# EAGLE design platform_smd2_driver (EAGLE 6.5.0)
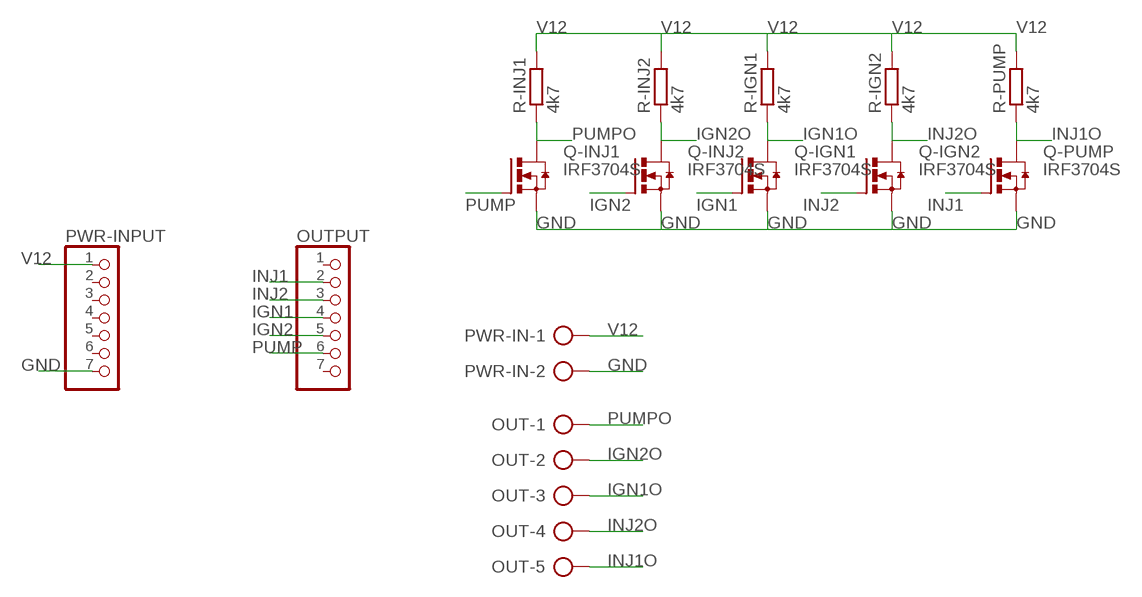
[diagram p0: schematic, sheet 1]

## Parts
OUT  AK300/5  [AK300/5]
OUTPUT  PINHD-1X7  [1X07]
PWR-IN  AK300/2  [AK300/2]
PWR-INPUT  PINHD-1X7  [1X07]
Q-IGN1  IRF3704S  [D2PACK]
Q-IGN2  IRF3704S  [D2PACK]
Q-INJ1  IRF3704S  [D2PACK]
Q-INJ2  IRF3704S  [D2PACK]
Q-PUMP  IRF3704S  [D2PACK]
R-IGN1  4k7  R-EU_M1206  [M1206]
R-IGN2  4k7  R-EU_M1206  [M1206]
R-INJ1  4k7  R-EU_M1206  [M1206]
R-INJ2  4k7  R-EU_M1206  [M1206]
R-PUMP  4k7  R-EU_M1206  [M1206]

## Nets
GND: PWR-IN.2 PWR-INPUT.7 Q-IGN1.3(S) Q-IGN2.3(S) Q-INJ1.3(S) Q-INJ2.3(S) Q-PUMP.3(S)
IGN1: OUTPUT.4 Q-IGN1.1(G)
IGN1O: OUT.3 Q-IGN1.2(D) R-IGN1.1
IGN2: OUTPUT.5 Q-INJ2.1(G)
IGN2O: OUT.2 Q-INJ2.2(D) R-INJ2.1
INJ1: OUTPUT.2 Q-PUMP.1(G)
INJ1O: OUT.5 Q-PUMP.2(D) R-PUMP.1
INJ2: OUTPUT.3 Q-IGN2.1(G)
INJ2O: OUT.4 Q-IGN2.2(D) R-IGN2.1
PUMP: OUTPUT.6 Q-INJ1.1(G)
PUMPO: OUT.1 Q-INJ1.2(D) R-INJ1.1
V12: PWR-IN.1 PWR-INPUT.1 R-IGN1.2 R-IGN2.2 R-INJ1.2 R-INJ2.2 R-PUMP.2
Unconnected: OUTPUT.1 OUTPUT.7 PWR-INPUT.2 PWR-INPUT.3 PWR-INPUT.4 PWR-INPUT.5 PWR-INPUT.6

## Library data of the parts
OUT = con-ptr500:AK300/5: CONNECTOR; OC_FARNELL: unknown; OC_NEWARK: unknown
OUTPUT PWR-INPUT = pinhead:PINHD-1X7: PIN HEADER
PWR-IN = con-ptr500:AK300/2: CONNECTOR; OC_FARNELL: unknown; OC_NEWARK: unknown
Q-IGN1 Q-IGN2 Q-INJ1 Q-INJ2 Q-PUMP = transistor-power:IRF3704: SMPS MOSFET HEXFET® Power MOSFET Source: http://www.irf.com/product-info/datasheets/data/irf3704.pdf
R-IGN1 R-IGN2 R-INJ1 R-INJ2 R-PUMP = resistor:R-EU_: RESISTOR, European symbol

## Board
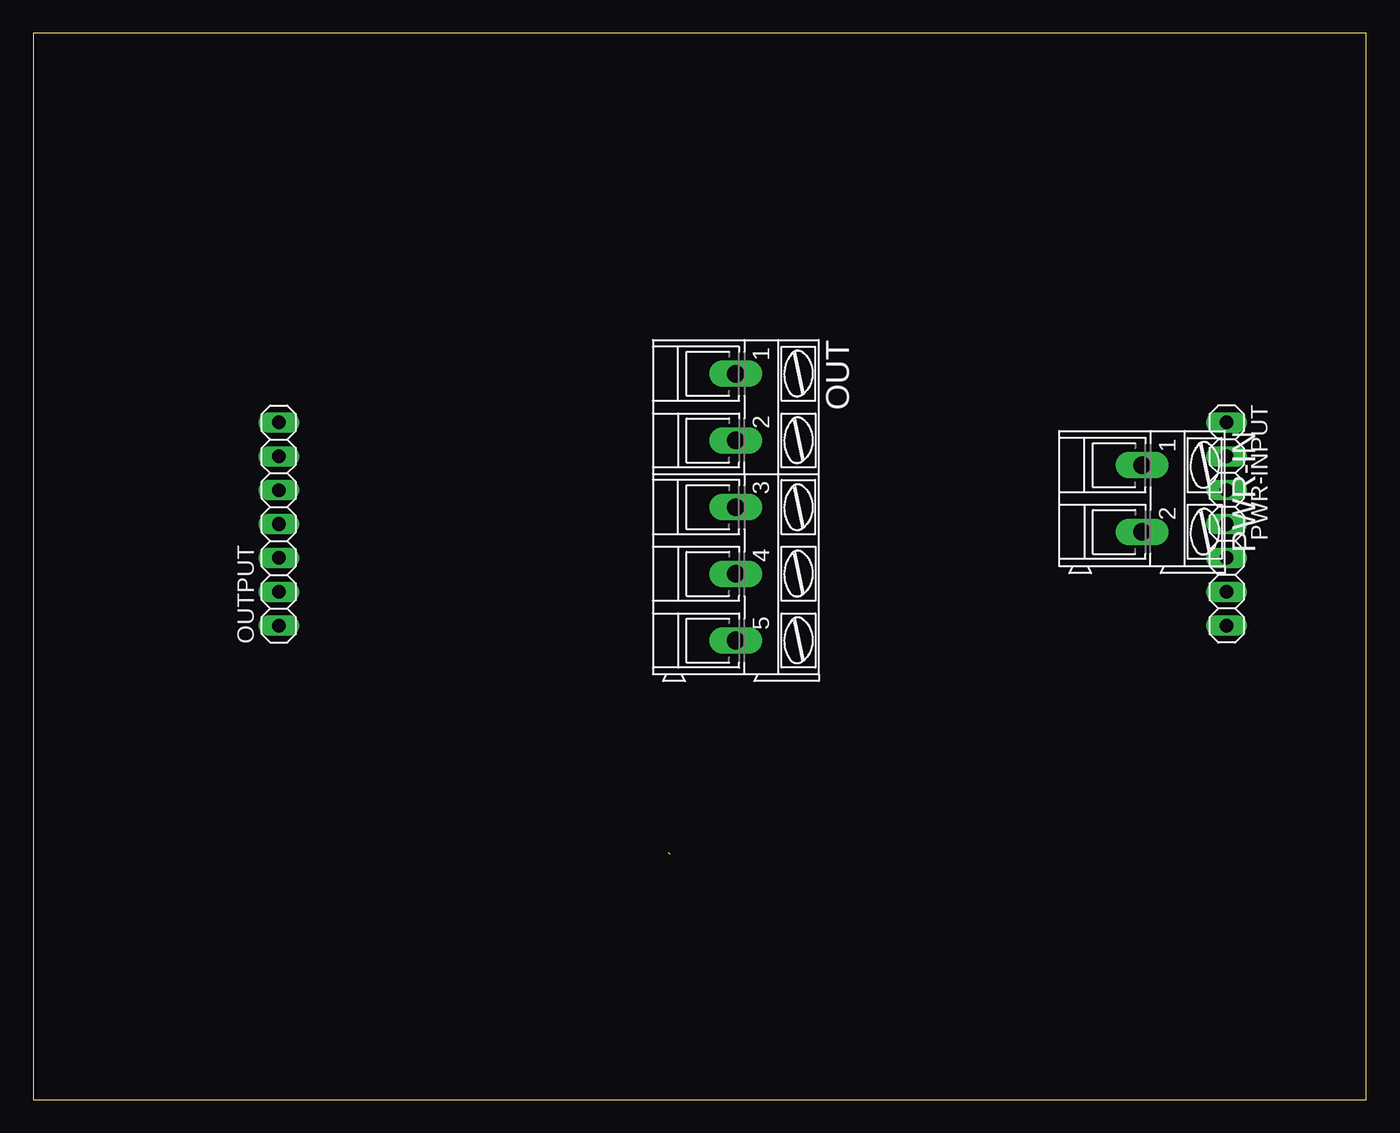
[diagram p1: board, top side]
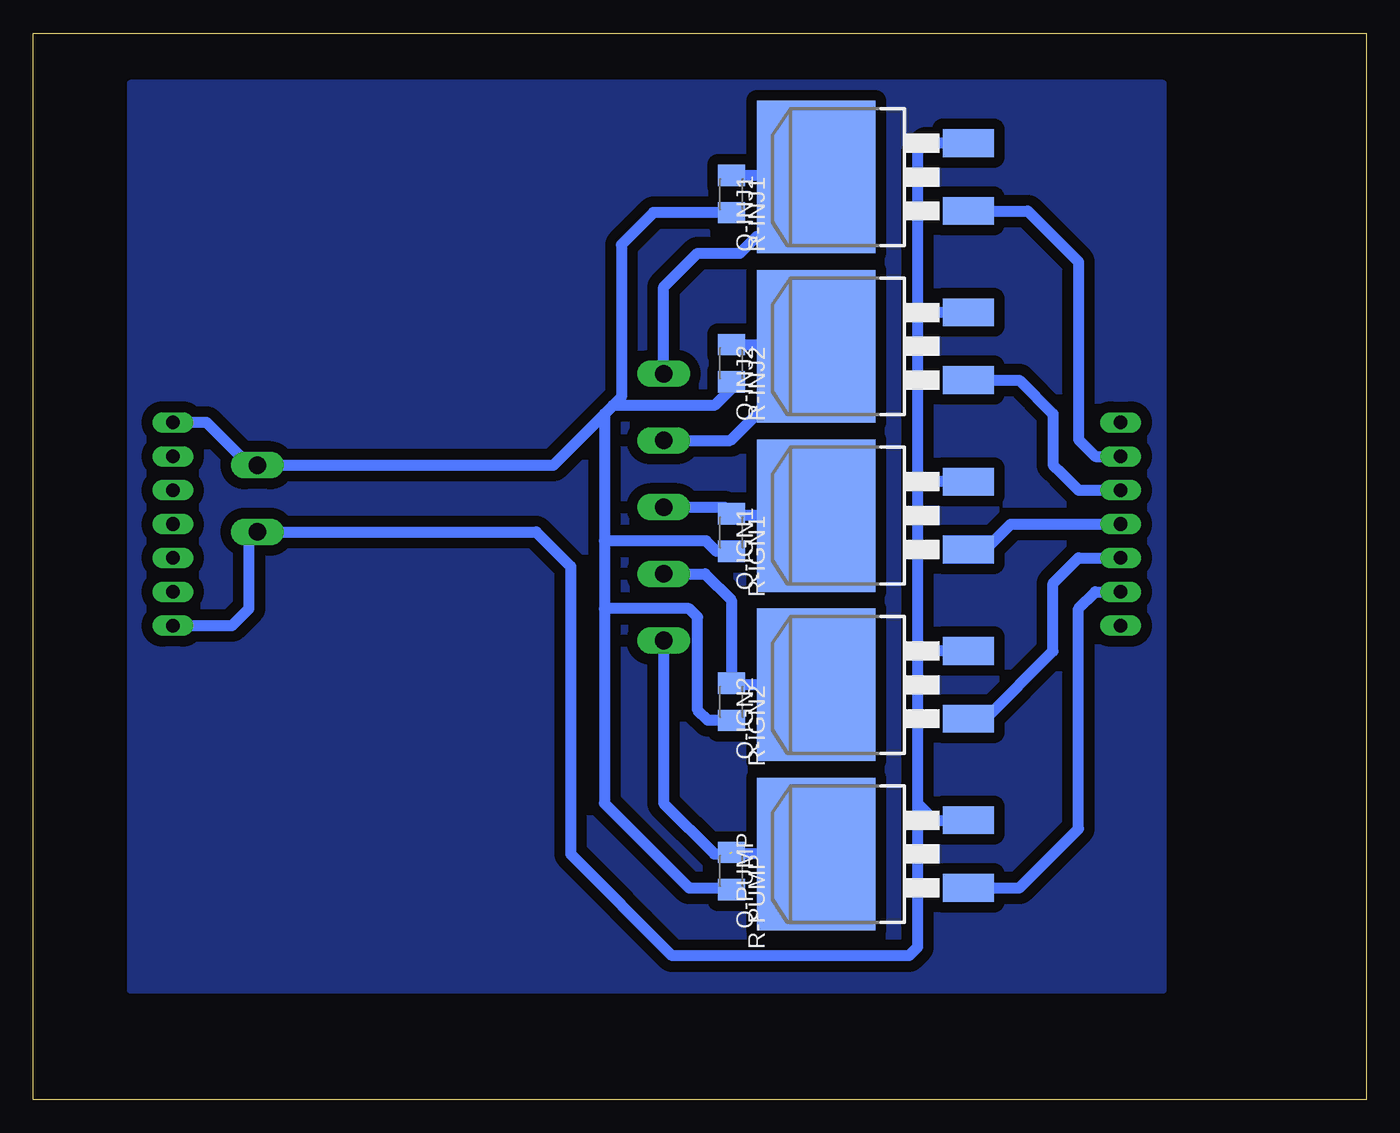
[diagram p2: board, bottom side, seen from below]

Size 100 x 80 mm. Coordinates in mm from the lower left corner, seen from the top.
Outline: 0,0 100,0 100,80 0,80 0,0
Copper layers (1*16): Top 0.035mm / dielectric 1.5mm / Bottom 0.035mm
Design rules "default": minimum track width 10mil, minimum drill 24mil, track to track 8mil, track to pad 8mil, pad to pad 8mil, via to via 8mil, smd to smd 8mil, copper to edge 40mil, drill to drill 8mil, minimum pad ring 10mil, minimum via ring 8mil, stop-mask expansion 4mil, vias tented up to drill 0mil, thermal gap 10mil

### Footprints (pad centres in the part's own frame; a part is rotated, then mirrored left to right if it is on the bottom)
AK300/5 = drill 1.321 long: 1 -10.008,0; 2 -5.004,0; 3 0,0; 4 5.004,0; 5 10.008,0
1X07 = drill 1.016 long: 1 -7.62,0; 2 -5.08,0; 3 -2.54,0; 4 0,0; 5 2.54,0; 6 5.08,0; 7 7.62,0
AK300/2 = drill 1.321 long: 1 -2.515,0; 2 2.489,0
D2PACK = smd 2.083 x 3.81: 1 -2.54,-8.89; 3 2.54,-8.89 | smd 11.43 x 8.89: 2 0,2.54
M1206 = smd 1.6 x 2: 1 -1.4,0; 2 1.4,0

### Placement (x,y rotation side)
OUT  52.7,44.45 270 top
OUTPUT  18.41,43.18 90 top
PWR-IN  83.19,45.09 270 top
PWR-INPUT  89.53,43.18 270 top
Q-IGN1  38.73,43.81 90 bottom
Q-IGN2  38.73,31.11 90 bottom
Q-INJ1  38.73,69.22 90 bottom
Q-INJ2  38.73,56.52 90 bottom
Q-PUMP  38.73,18.41 90 bottom
R-IGN1  47.62,42.55 270 bottom
R-IGN2  47.62,29.84 270 bottom
R-INJ1  47.62,67.94 270 bottom
R-INJ2  47.62,55.24 270 bottom
R-PUMP  47.62,17.14 270 bottom

### Tracks (layer width: path | path; a pad name or v marks a point on that pad's centre or on a via)
GND
  Bottom 0.813: Q-INJ1.3 33.02,71.75 33.66,71.12 33.66,59.05 | 33.66,59.05 33.66,46.35 | 33.66,46.35 33.66,33.66 | 33.66,33.66 33.66,22.23 | 33.66,22.23 32.38,20.95 Q-PUMP.3 | Q-IGN2.3 33.66,33.66 | Q-IGN1.3 33.66,46.35 | Q-INJ2.3 33.66,59.05 | PWR-INPUT.7 85.09,35.56 83.82,36.83 83.82,41.96 PWR-IN.2 62.28,42.6 59.69,40.01 59.69,18.41 52.07,10.79 34.29,10.79 33.66,11.43 33.66,22.23
IGN1
  Bottom 0.813: Q-IGN1.1 28.57,41.27 26.67,43.18 OUTPUT.4
IGN1O
  Bottom 0.813: Q-IGN1.2 47.49,43.81 R-IGN1.1 48.13,44.45 OUT.3
IGN2
  Bottom 0.813: Q-INJ2.1 26.04,53.98 23.5,51.44 23.5,47.62 22.86,46.99 21.91,46.04 21.59,45.72 OUTPUT.5
IGN2O
  Bottom 0.813: R-INJ2.1 42.55,56.65 | 42.55,56.65 41.41,56.65 Q-INJ2.2 | OUT.2 47.7,49.45 44.45,52.7 44.45,54.74 42.55,56.65
INJ1
  Bottom 0.813: Q-PUMP.1 26.04,15.88 21.59,20.32 21.59,36.83 20.32,38.1 OUTPUT.2
INJ1O  (1 unrouted)
  Bottom 0.813: Q-PUMP.2 47.49,18.41 R-PUMP.1 | OUT.5 52.7,22.23 48.9,18.41 47.76,18.41
INJ2
  Bottom 0.813: Q-IGN2.1 28.57,28.57 23.5,33.66 23.5,38.73 21.59,40.64 OUTPUT.3
INJ2O
  Bottom 0.813: Q-IGN2.2 47.49,31.11 R-IGN2.1 47.62,37.47 49.61,39.45 OUT.4
N$1
  pour Bottom (isolate 0.813): 15.24,76.2 92.71,76.2 92.71,8.26 15.24,8.26
PUMP
  Bottom 0.813: Q-INJ1.1 25.4,66.67 21.59,62.87 21.59,49.53 20.32,48.26 OUTPUT.6
PUMPO
  Bottom 0.813: R-INJ1.1 42.04,69.34 41.91,69.22 Q-INJ1.2 41.27,64.77 41.91,65.41 43.81,65.41 44.45,64.77 45.72,64.77 46.99,63.5 50.16,63.5 52.7,60.96 OUT.1
V12
  Bottom 0.813: R-INJ2.2 47.62,53.34 48.9,52.07 56.52,52.07 | 56.52,52.07 57.15,51.44 | 57.15,51.44 57.15,41.91 | 57.15,41.91 57.15,36.83 | 57.15,36.83 57.15,22.23 50.8,15.88 47.76,15.88 R-PUMP.2 | R-IGN2.2 49.4,28.45 50.16,29.21 50.16,36.2 50.8,36.83 57.15,36.83 | R-IGN1.2 48.77,41.15 49.53,41.91 57.15,41.91 | 57.15,51.44 60.98,47.6 PWR-IN.1 83.8,47.6 87,50.8 PWR-INPUT.1 | R-INJ1.2 53.47,66.55 55.88,64.14 55.88,52.7 56.52,52.07